# Altium schematic sheet Arduino.SchDoc
size A4
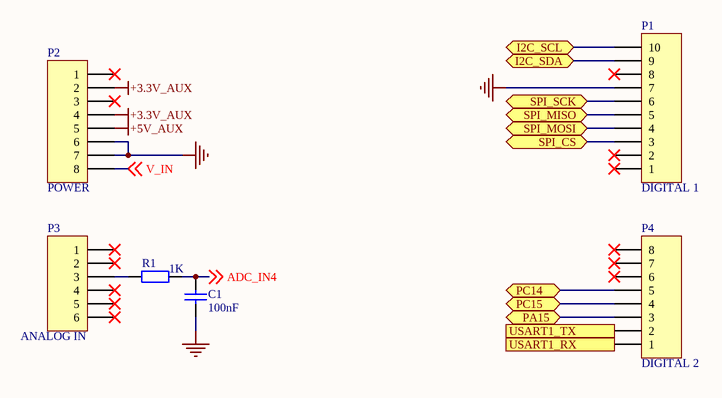
[diagram p0: Arduino.SchDoc]

## Parts
C1  value 100nF  [C0402]  (hidden comment: Capacitor ceramic)
P1  DIGITAL 1  [HDR1X10]
P2  POWER  [HDR1X8]  (no BOM)
P3  ANALOG IN  [HDR1X6]  (no BOM)
P4  DIGITAL 2  [HDR1X8]  (no BOM)
R1  value 1K  [R0402]  (hidden comment: Resistor)

## Ports
I2C_SCL (bidir), I2C_SDA (bidir), PA15 (bidir), PC14 (bidir), PC15 (bidir), SPI_CS (bidir), SPI_MISO (bidir), SPI_MOSI (bidir), SPI_SCK (bidir), USART1_RX (out), USART1_TX (in)

## Nets
+3.3V_AUX: P2.2 P2.4
+5V_AUX: P2.5
GND: C1.2 P1.7 P2.6 P2.7
ADC_IN4: C1.1 R1.2 ; off-sheet ADC_IN4
I2C_SCL: P1.10 ; port I2C_SCL
I2C_SDA: P1.9 ; port I2C_SDA
PA15: P4.3 ; port PA15
PC14: P4.5 ; port PC14
PC15: P4.4 ; port PC15
SPI_CS: P1.3 ; port SPI_CS
SPI_MISO: P1.5 ; port SPI_MISO
SPI_MOSI: P1.4 ; port SPI_MOSI
SPI_SCK: P1.6 ; port SPI_SCK
USART1_RX: P4.1 ; port USART1_RX
USART1_TX: P4.2 ; port USART1_TX
V_IN: P2.8 ; off-sheet V_IN
NetP3_3: P3.3 R1.1

Not connected (* = marked no-connect by the designer): P1 1* 2* 8*; P2 1* 3*; P3 1* 2* 4* 5* 6*; P4 6* 7* 8*

## Library data of the parts
C1 = Cap: Manufacturer: TDK Corporation; Manufacturer Part No.: CGA2B3X7R1V104K050BB; Part Description: Ceramic Capacitor; Specification: X7R, 35V, 10%; Link: https://www.digikey.com/product-detail/en/tdk-corporation/CGA2B3X7R1V104K050BB/445-6901-1-ND/2672919; Supplier: DigiKey; Supplier part number: 445-6901-1-ND
P1 = Header 10: Manufacturer: SparkFun Electronics; Manufacturer Part No.: PRT-11417; Part Description: ARDUINO STACKABLE HEADER KIT - R; Specification: 10 pos. 2,54mm; Value: PRT-11417; Supplier: DigiKey; Supplier part number: 1568-1413-ND; Link: https://www.digikey.com/product-detail/en/sparkfun-electronics/PRT-11417/1568-1413-ND/6161755
P2 P4 = Header 8: Manufacturer: ADAM TECH; Manufacturer Part No.: RS1-08-G; Part Description: Arduino Connector; Specification: 8 pos. 2,54mm; Value: RS1-08-G; Supplier: Rutronik; Supplier part number: CONN2043; Link: http://www.adam-tech.com/products.php
P3 = Header 6: Manufacturer: ADAM TECH; Manufacturer Part No.: RS1-06-G; Part Description: Arduino Connector; Specification: 6 pos. 2,54mm; Value: RS1-06-G; Supplier: Rutronik; Supplier part number: CONN2042; Link: http://www.adam-tech.com/products.php
R1 = Res2: Manufacturer: Yageo; Manufacturer Part No.: AC0402JR-071KL; Part Description: Thick Film Resistor; Specification: 5% 0,063W; Link: https://www.digikey.com/product-detail/en/yageo/AC0402JR-071KL/YAG3525CT-ND/6006374; Supplier: DigiKey; Supplier part number: YAG3525CT-ND